# EAGLE design smd-reflow-2-rendered (EAGLE 7.2.0)
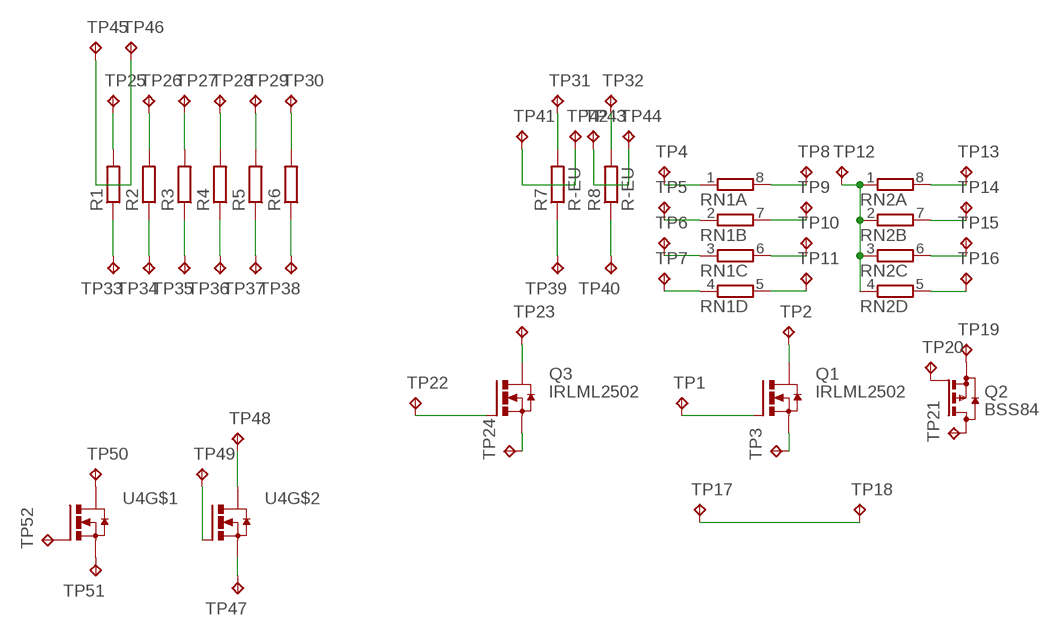
[diagram p0: schematic, sheet 1]

## Parts
Q1  IRLML2502  [MICRO3]
Q2  BSS84  [SOT23]
Q3  IRLML2502  [MICRO3]
R1  R-EU_R0603  [R0603]
R2  R-EU_R0603  [R0603]
R3  R-EU_R0805  [R0805]
R4  R-EU_R0805  [R0805]
R5  R-EU_R0805W  [R0805W]
R6  R-EU_R0805W  [R0805W]
R7  R-EU  [R0805H]
R8  R-EU  [R0805H]
RN1  4R-NEXB38V  [EXB38V]
RN2  4R-NEXB38V  [EXB38V]
TP1  TPB1,27  [B1,27]
TP2  TPB1,27  [B1,27]
TP3  TPB1,27  [B1,27]
TP4  TPB1,27  [B1,27]
TP5  TPB1,27  [B1,27]
TP6  TPB1,27  [B1,27]
TP7  TPB1,27  [B1,27]
TP8  TPB1,27  [B1,27]
TP9  TPB1,27  [B1,27]
TP10  TPB1,27  [B1,27]
TP11  TPB1,27  [B1,27]
TP12  TPB1,27  [B1,27]
TP13  TPB1,27  [B1,27]
TP14  TPB1,27  [B1,27]
TP15  TPB1,27  [B1,27]
TP16  TPB1,27  [B1,27]
TP17  TPB1,27  [B1,27]
TP18  TPB1,27  [B1,27]
TP19  TPB1,27  [B1,27]
TP20  TPB1,27  [B1,27]
TP21  TPB1,27  [B1,27]
TP22  TPB1,27  [B1,27]
TP23  TPB1,27  [B1,27]
TP24  TPB1,27  [B1,27]
TP25  TPB1,27  [B1,27]
TP26  TPB1,27  [B1,27]
TP27  TPB1,27  [B1,27]
TP28  TPB1,27  [B1,27]
TP29  TPB1,27  [B1,27]
TP30  TPB1,27  [B1,27]
TP31  TPB1,27  [B1,27]
TP32  TPB1,27  [B1,27]
TP33  TPB1,27  [B1,27]
TP34  TPB1,27  [B1,27]
TP35  TPB1,27  [B1,27]
TP36  TPB1,27  [B1,27]
TP37  TPB1,27  [B1,27]
TP38  TPB1,27  [B1,27]
TP39  TPB1,27  [B1,27]
TP40  TPB1,27  [B1,27]
TP41  TPB1,27  [B1,27]
TP42  TPB1,27  [B1,27]
TP43  TPB1,27  [B1,27]
TP44  TPB1,27  [B1,27]
TP45  TPB1,27  [B1,27]
TP46  TPB1,27  [B1,27]
TP47  TPB1,27  [B1,27]
TP48  TPB1,27  [B1,27]
TP49  TPB1,27  [B1,27]
TP50  TPB1,27  [B1,27]
TP51  TPB1,27  [B1,27]
TP52  TPB1,27  [B1,27]
U4  2N7002GW  [SOT363_INFINEON]

## Nets
N$1: RN1.1 TP4.TP
N$2: RN1.2 TP5.TP
N$3: RN1.3 TP6.TP
N$4: RN1.4 TP7.TP
N$5: RN1.8 TP8.TP
N$6: RN1.7 TP9.TP
N$7: RN1.6 TP10.TP
N$8: RN1.5 TP11.TP
N$9: RN2.1 RN2.2 RN2.3 RN2.4 TP12.TP
N$10: RN2.8 TP13.TP
N$11: RN2.7 TP14.TP
N$12: RN2.6 TP15.TP
N$13: RN2.5 TP16.TP
N$14: Q1.3(D) TP2.TP
N$15: Q1.1(G) TP1.TP
N$16: Q1.2(S) TP3.TP
N$17: TP17.TP TP18.TP
N$18: Q2.2(S) TP19.TP
N$19: Q2.1(G) TP20.TP
N$20: Q2.3(D) TP21.TP
N$21: Q3.3(D) TP23.TP
N$22: Q3.1(G) TP22.TP
N$23: Q3.2(S) TP24.TP
N$24: R1.2 TP25.TP
N$25: R2.2 TP26.TP
N$26: R3.2 TP27.TP
N$27: R4.2 TP28.TP
N$28: R6.2 TP30.TP
N$29: R5.2 TP29.TP
N$30: R7.2 TP31.TP
N$31: R8.2 TP32.TP
N$32: R1.1 TP33.TP
N$33: R2.1 TP34.TP
N$34: R3.1 TP35.TP
N$35: R4.1 TP36.TP
N$36: R5.1 TP37.TP
N$37: R6.1 TP38.TP
N$38: R7.1 TP39.TP
N$39: R8.1 TP40.TP
N$40: TP41.TP TP42.TP
N$41: TP43.TP TP44.TP
N$42: TP45.TP TP46.TP
N$44 [pwr]: TP47.TP U4.4(S)
N$45: TP49.TP U4.5(G)
N$46: TP50.TP U4.6(D)
N$47: TP48.TP U4.3(D)
N$48: TP51.TP U4.1(S)
N$49: TP52.TP U4.2(G)

## Library data of the parts
Q1 Q3 = trainlib:IRLML2502: HEXFET Power MosFet 20V, 4.5A, 0.045R SOT-23 package Source: http://www.irf.com/
Q2 = transistor-small-signal:BSS84: P-CHANNEL MOS FET
R1-R6 = resistor:R-EU_: RESISTOR, European symbol
R7 R8 = trainlib:R-EU
RN1 RN2 = resistor-dil:4R-N: Array Chip Resistor Source: RS Component / Phycomp; OC_FARNELL: unknown; OC_NEWARK: unknown
TP1-TP52 = testpad:TP: Test pad
U4 = trainlib:2N7002: 2N7002GW OptiMOS Dual n-channel small signal MOSFET in SOT363 package. Vds=60V, Imax=0.3A, R=3

## Net classes
1 pwr: width 0.254 mm
2 hipwr: width 0.5 mm

## Board
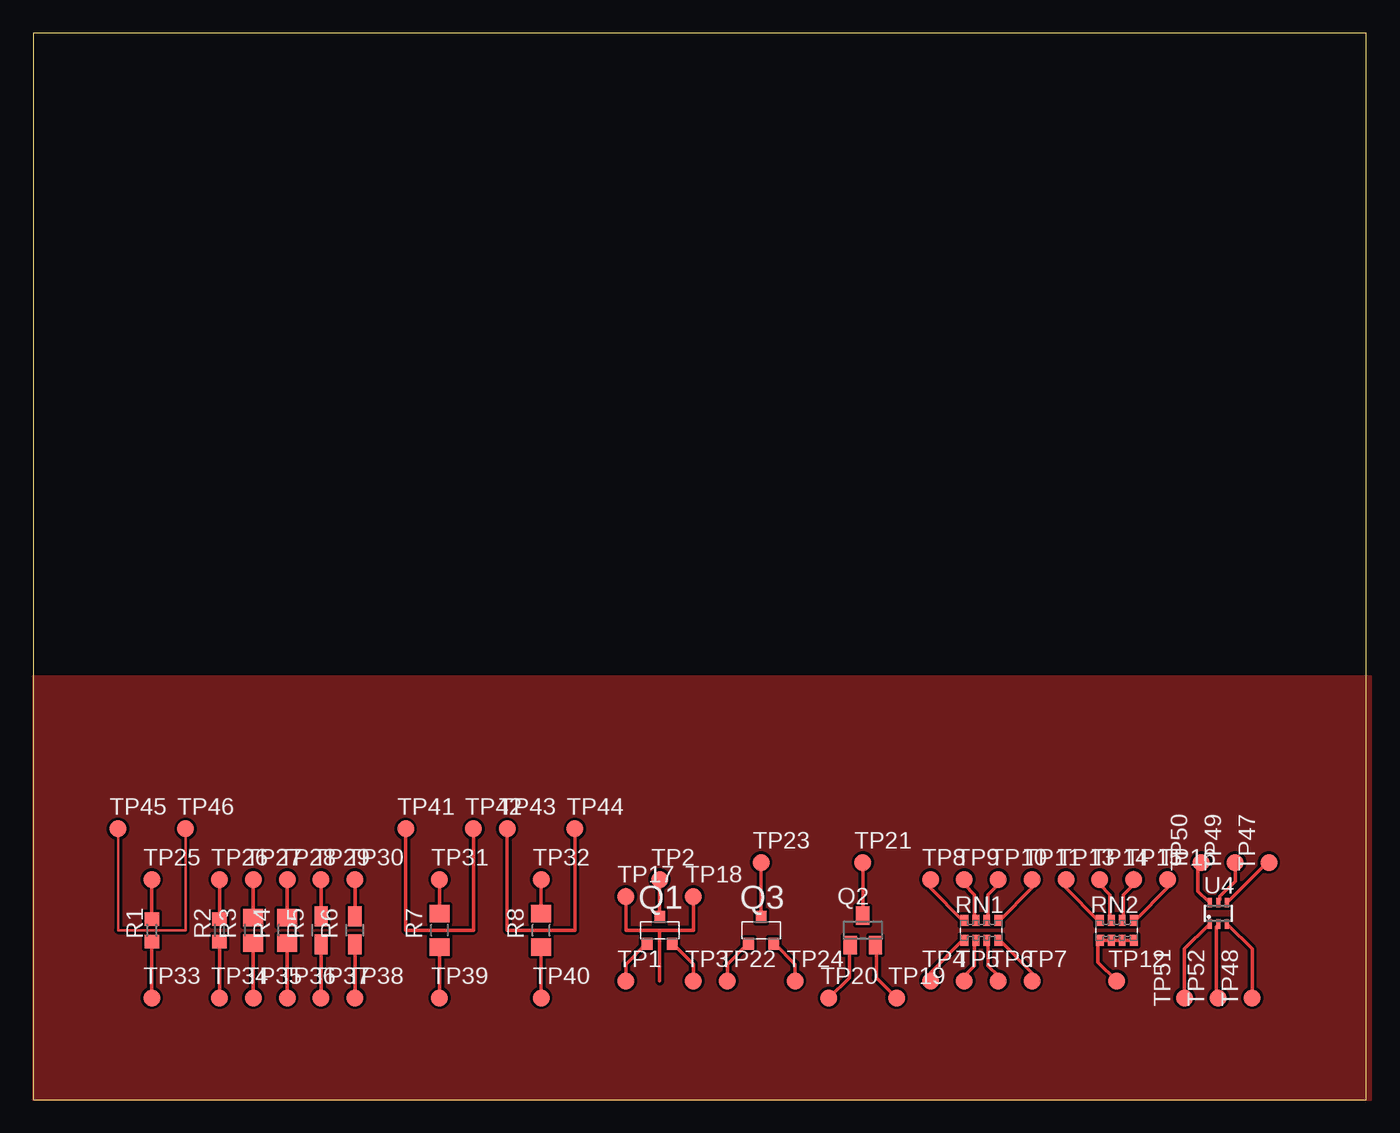
[diagram p1: board, top side]

Size 100 x 80 mm. Coordinates in mm from the lower left corner, seen from the top.
Outline: 0,0 100,0 100,80 0,80 0,0
Copper layers (1*16): Top 0.035mm / dielectric 1.5mm / Bottom 0.035mm
Design rules "default *": minimum track width 10mil, minimum drill 24mil, track to track 8mil, track to pad 8mil, pad to pad 8mil, via to via 8mil, smd to smd 8mil, copper to edge 0mil, drill to drill 8mil, minimum pad ring 10mil, minimum via ring 8mil, stop-mask expansion 4mil, vias tented up to drill 0mil, thermal gap 10mil

### Footprints (pad centres in the part's own frame; a part is rotated, then mirrored left to right if it is on the bottom)
MICRO3 = smd 0.8 x 0.9: 1 -0.95,-1; 2 0.95,-1; 3 0,1
SOT23 = smd 1 x 1.4: 1 -0.95,-1.1; 2 0.95,-1.1; 3 0,1.1
R0603 = smd 1 x 1.1: 1 -0.85,0; 2 0.85,0
R0805 = smd 1.3 x 1.5: 1 -0.95,0; 2 0.95,0
R0805W = smd 1.5 x 1: 1 -1.052,0; 2 1.052,0
R0805H = smd 1.3 x 1.5: 1 -1.255,0; 2 1.255,0
EXB38V = smd 0.6 x 0.8: 1 -1.275,-0.75; 4 1.275,-0.75; 5 1.275,0.75; 8 -1.275,0.75 | smd 0.5 x 0.8: 2 -0.4,-0.75; 3 0.4,-0.75; 6 0.4,0.75; 7 -0.4,0.75
B1,27 = smd 1.27 x 1.27: TP 0,0
SOT363_INFINEON = smd 0.3 x 0.7: 1 -0.65,-0.8; 2 0,-0.8; 3 0.65,-0.8; 4 0.65,0.8; 5 0,0.8; 6 -0.65,0.8

### Placement (x,y rotation side)
Q1  46.99,12.7 0 top
Q2  62.23,12.7 0 top
Q3  54.61,12.7 0 top
R1  8.89,12.7 90 top
R2  13.97,12.7 90 top
R3  16.51,12.7 90 top
R4  19.05,12.7 90 top
R5  21.59,12.7 90 top
R6  24.13,12.7 90 top
R7  30.48,12.7 90 top
R8  38.1,12.7 90 top
RN1  71.12,12.7 0 top
RN2  81.28,12.7 0 top
TP1  44.45,8.89 0 top
TP2  46.99,16.51 0 top
TP3  49.53,8.89 0 top
TP4  67.31,8.89 0 top
TP5  69.85,8.89 0 top
TP6  72.39,8.89 0 top
TP7  74.93,8.89 0 top
TP8  67.31,16.51 0 top
TP9  69.85,16.51 0 top
TP10  72.39,16.51 0 top
TP11  74.93,16.51 0 top
TP12  81.28,8.89 0 top
TP13  77.47,16.51 0 top
TP14  80.01,16.51 0 top
TP15  82.55,16.51 0 top
TP16  85.09,16.51 0 top
TP17  44.45,15.24 0 top
TP18  49.53,15.24 0 top
TP19  64.77,7.62 0 top
TP20  59.69,7.62 0 top
TP21  62.23,17.78 0 top
TP22  52.07,8.89 0 top
TP23  54.61,17.78 0 top
TP24  57.15,8.89 0 top
TP25  8.89,16.51 0 top
TP26  13.97,16.51 0 top
TP27  16.51,16.51 0 top
TP28  19.05,16.51 0 top
TP29  21.59,16.51 0 top
TP30  24.13,16.51 0 top
TP31  30.48,16.51 0 top
TP32  38.1,16.51 0 top
TP33  8.89,7.62 0 top
TP34  13.97,7.62 0 top
TP35  16.51,7.62 0 top
TP36  19.05,7.62 0 top
TP37  21.59,7.62 0 top
TP38  24.13,7.62 0 top
TP39  30.48,7.62 0 top
TP40  38.1,7.62 0 top
TP41  27.94,20.32 0 top
TP42  33.02,20.32 0 top
TP43  35.56,20.32 0 top
TP44  40.64,20.32 0 top
TP45  6.35,20.32 0 top
TP46  11.43,20.32 0 top
TP47  92.71,17.78 90 top
TP48  91.44,7.62 90 top
TP49  90.17,17.78 90 top
TP50  87.63,17.78 90 top
TP51  86.36,7.62 90 top
TP52  88.9,7.62 90 top
U4  88.9,13.97 0 top

### Tracks (layer width: path | path; a pad name or v marks a point on that pad's centre or on a via)
N$1
  Top 0.254: TP4.TP 67.31,9.53 69.72,11.94 RN1.1
N$2
  Top 0.254: TP5.TP 69.85,9.27 70.61,10.03 70.61,11.94 RN1.2
N$3
  Top 0.254: TP6.TP 72.39,9.27 71.63,10.03 71.63,11.94 RN1.3
N$4
  Top 0.254: TP7.TP 74.93,9.53 72.52,11.94 RN1.4
N$5
  Top 0.254: TP8.TP 67.31,15.88 69.72,13.46 RN1.8
N$6
  Top 0.254: TP9.TP 69.85,16.13 70.61,15.37 70.61,13.46 RN1.7
N$7
  Top 0.254: TP10.TP 72.39,16.13 71.63,15.37 71.63,13.46 RN1.6
N$8
  Top 0.254: TP11.TP 74.93,15.88 72.52,13.46 RN1.5
N$9
  Top 0.254: RN2.4 82.55,11.94 81.79,11.94 RN2.3 81.66,11.94 80.9,11.94 RN2.2 80.77,11.94 80.01,11.94 RN2.1 79.88,11.94 79.88,10.29 TP12.TP
N$10
  Top 0.254: TP13.TP 77.47,15.88 79.88,13.46 RN2.8
N$11
  Top 0.254: TP14.TP 80.01,16.13 80.77,15.37 80.77,13.46 RN2.7
N$12
  Top 0.254: TP15.TP 82.55,16.13 81.79,15.37 81.79,13.46 RN2.6
N$13
  Top 0.254: TP16.TP 85.09,15.88 82.68,13.46 RN2.5
N$14
  Top 0.254: TP2.TP Q1.3
N$15
  Top 0.254: TP1.TP 44.45,10.16 45.97,11.68 Q1.1
N$16
  Top 0.254: TP3.TP 49.53,10.16 48.01,11.68 Q1.2
N$17
  Top 0.254: TP17.TP 44.45,12.7 46.99,12.7 | TP18.TP 49.53,12.7 46.99,12.7 | 46.99,12.7 46.99,8.89
N$18
  Top 0.254: TP19.TP 63.25,9.14 63.25,11.56 Q2.2
N$19
  Top 0.254: TP20.TP 61.21,9.14 61.21,11.56 Q2.1
N$20
  Top 0.254: Q2.3 TP21.TP
N$21
  Top 0.254: TP23.TP Q3.3
N$22
  Top 0.254: TP22.TP 52.07,10.16 53.59,11.68 Q3.1
N$23
  Top 0.254: TP24.TP 57.15,10.16 55.63,11.68 Q3.2
N$24
  Top 0.254: TP25.TP R1.2
N$25
  Top 0.254: TP26.TP R2.2
N$26
  Top 0.254: R3.2 TP27.TP
N$27
  Top 0.254: R4.2 TP28.TP
N$28
  Top 0.254: R6.2 TP30.TP
N$29
  Top 0.254: R5.2 TP29.TP
N$30
  Top 0.254: R7.2 TP31.TP
N$31
  Top 0.254: R8.2 TP32.TP
N$32
  Top 0.254: TP33.TP R1.1
N$33
  Top 0.254: TP34.TP R2.1
N$34
  Top 0.254: R3.1 TP35.TP
N$35
  Top 0.254: R4.1 TP36.TP
N$36
  Top 0.254: R5.1 TP37.TP
N$37
  Top 0.254: R6.1 TP38.TP
N$38
  Top 0.254: R7.1 TP39.TP
N$39
  Top 0.254: R8.1 TP40.TP
N$40
  Top 0.254: TP41.TP 27.94,12.7 33.02,12.7 TP42.TP
N$41
  Top 0.254: TP43.TP 35.56,12.7 40.64,12.7 TP44.TP
N$42
  Top 0.203: TP45.TP 6.35,12.7 11.43,12.7 TP46.TP
N$43
  pour Top: 0,31.75 100.33,31.75 100.33,0 0,0
N$44
  Top 0.254: TP47.TP 92.58,17.78 89.66,14.86 U4.4
N$45
  Top 0.254: TP49.TP 90.17,16.38 89.03,15.24 89.03,14.99 88.9,14.86 U4.5
N$46
  Top 0.254: TP50.TP 87.38,17.53 87.38,15.62 88.14,14.86 U4.6
N$47
  Top 0.254: TP48.TP 91.44,11.3 89.66,13.08 U4.3
N$48
  Top 0.254: TP51.TP 86.36,11.3 88.14,13.08 U4.1
N$49
  Top 0.254: TP52.TP 88.77,7.75 88.77,12.95 88.9,13.08 U4.2